# EAGLE design OLED(64x32)V2 (EAGLE 6.5.0)
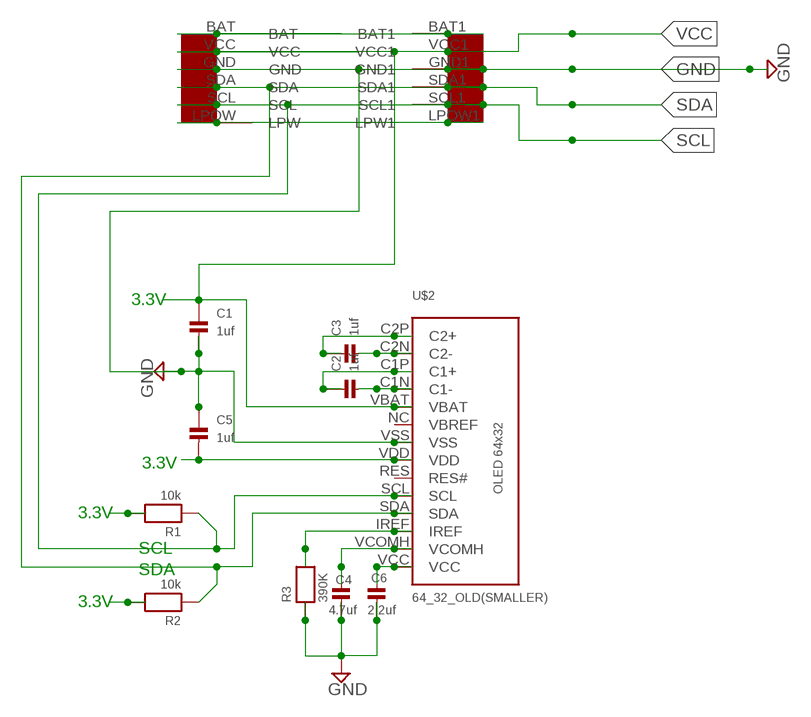
[diagram p0: schematic, sheet 1]

## Parts
C1  1uf  CAP_CERAMIC0603  [0603]
C2  1uf  CAP_CERAMIC0603  [0603]
C3  1uf  CAP_CERAMIC0603  [0603]
C4  4.7uf  CAP_CERAMIC0603  [0603]
C5  1uf  CAP_CERAMIC0603  [0603]
C6  2.2uf  CAP_CERAMIC0603  [0603]
R1  10k  RESISTOR0603  [0603]
R2  10k  RESISTOR0603  [0603]
R3  390K  RESISTOR0603  [0603]
U$1  EZ-I2CHEADERV1  [EZ-I2CHEADERV1]
U$2  64_32_OLD(SMALLER)  [62_32_OLED(SMALLER)]

## Nets
BAT: U$1.BAT U$1.BAT1
GND: C1.2 C4.2 C5.1 C6.2 R3.1 U$1.GND U$1.GND1 U$2.VSS
LPW: U$1.LPOW1(LPW1) U$1.LPOW(LPW)
N$2: C2.2 U$2.C1N(C1-)
N$3: C2.1 U$2.C1P(C1+)
N$4: C3.2 U$2.C2N(C2-)
N$5: C3.1 U$2.C2P(C2+)
N$6: R3.2 U$2.IREF
N$7: C4.1 U$2.VCOMH
N$8: C6.1 U$2.VCC
SCL: R1.1 U$1.SCL U$1.SCL1 U$2.SCL
SDA: R2.1 U$1.SDA U$1.SDA1 U$2.SDA
VCC: C1.1 C5.2 R1.2 R2.2 U$1.VCC U$1.VCC1 U$2.VBAT U$2.VDD
Unconnected: U$2.NC(VBREF) U$2.RES(RES#)

## Notes on the sheet
- 3.3V
- 3.3V
- 3.3V
- SCL
- SDA
- 3.3V

## Library data of the parts
C1-C6 = microbuilder:CAP_CERAMIC: Ceramic Capacitors 0402 - 0402 Surface Mount Capacitors 16pF 50V 5% [Digikey: 445-4899-2-ND] 18pF 50V 5% [Digikey: 490-1281-2-ND] 22pF 50V 5% [Digikey: 490-1283-2-ND] 68pF 50V 5% [Digikey: 490-1289-2-ND] 0.1uF 10V 10% [Digikey: 490-1318-2-ND] 1.0uF 6.3V 10% [Digikey: 490-1320-2-ND] 0603 - 0603 Surface Mount Capacitors 16 pF 50V 5% [Digikey: 445-5051-2-ND] 22 pF 50V [Digikey: PCC220ACVTR-ND] 33 pF 50V 5% [Digikey: 490-1415-1-ND] 56pF 50V 5% [Digikey: 490-1421-1-ND] 220pF 50V 5% [Digikey: 445-1285-1-ND] 680 pF 50V 2200 pF 50V 5% C0G [Digikey: 445-1297-1-ND] 5600 pF 100V 5% X7R [Digikey: 478-3711-1-ND] 0.1 µF 25V 10% [Digikey: PCC2277TR-ND] 0.22 µF 16V 10% X7R [Digikey: 445-1318-1-ND] 1.0 µF 25V 10% [Digikey: 445-5146-2-ND] 0603 - RF Specific 3pF 250V +/-0.1pF RF [Digikey: 712-1347-1-ND] 18 pF 250V 5% [Digikey: 478-3505-1-ND or 712-1322-1-ND] 56 pF 250V 5% C0G RF [Digikey: 490-4867-1-ND] 68 pF 250V RF [Digikey: 490-4868-1-ND] 0805 - 0805 Surface Mount Capacitors 220 pF 250V 2% RF Ceramic Capacitor [Digikey: 712-1398-1-ND] 1000 pF 50V 2% NP0 Ceramic Capacitor [Digikey: 478-3760-1-ND] 0.1 µF 25V 10% Ceramic Capacitor [Digikey: PCC1828TR-ND] 1.0 µF 16V 10% Ceramic Capacitor[Digikey: 490-1691-2-ND] 10.0 µF 10V 10% Ceramic Capacitor[Digikey: 709-1228-1-ND] 10.0 uF 16V 10% Ceramic Capacitor [Digikey: 478-5165-2-ND] 47 uF 6.3V 20% Ceramic Capacitor [Digikey: 587-1779-1-ND or 399-5506-1-ND] 1206 - 1206 Surface Mount Capacitors 47uF 10V 20% Ceramic Capacitor [Digikey: 490-5528-1-ND or 399-5508-1-ND or 445-6010-1-ND] 100uF 6.3V -20%, +80% Y5V Ceramic Capacitor (Digikey: 490-4512-1-ND, Mouser: 81-GRM31CF50J107ZE1L)
R1-R3 = microbuilder:RESISTOR: Resistors 0402 - 0402 Surface Mount Package 22 Ohm 1% 1/16W [Digikey: 311-22.0LRTR-ND] 33 Ohm 5% 1/16W 1.0K 5% 1/16W 1.5K 5% 1/16W 2.0K 1% 1/16W 10.0K 1% 1/16W [Digikey: 311-10.0KLRTR-ND] 10.0K 5% 1/16W [Digikey: RMCF0402JT10K0TR-ND] 12.1K 1% 1/16W [Digikey: 311-22.0LRTR-ND] 100.0K 5% 1/16W 0603 - 0603 Surface Mount Package 0 Ohm 1/10 Watt 1% Resistor 15 Ohm 1/10 Watt 1% Resistor 33 Ohm 1/10 Watt 1% Resistor 49.9 Ohm 1/10 Watt 1% Resistor 100 Ohm 1/10 Watt 1% Resistor 150 Ohm 1/10 Watt 1% Resistor 240 Ohm 1/10 Watt 1% Resistor 390 Ohm 1/10 Watt 1% Resistor 560 Ohm 1/10 Watt 1% Resistor 680 Ohm 1/10 Watt 1% Resistor 750 Ohm 1/10 Watt 1% Resistor 1.0K Ohm 1/10 Watt 1% Resistor 1.5K Ohm 1/10 Watt 1% Resistor 2.0K Ohm 1/10 Watt 1% Resistor 2.2K Ohm 1/10 Watt 1% Resistor 3.3K Ohm 1/10 Watt 1% Resistor 4.7K Ohm 1/10 Watt 1% Resistor 10.0K Ohm 1/10 Watt 1% Resistor 12.0K Ohm 1/10 Watt 1% Resistor 12.1K Ohm 1/10 Watt 1% Resistor 20.0K Ohm 1/10 Watt 1% Resistor 33.0K Ohm 1/10 Watt 1% Resistor 100.0K Ohm 1/10 Watt 1% Resistor 0805 - 0805 Surface Mount Package 0 Ohm 1/8 Watt 1% Resistor 33 Ohm 1/8 Watt 1% Resistor 100 Ohm 1/8 Watt 1% Resistor 150 Ohm 1/8 Watt 1% Resistor 200 Ohm 1/8 Watt 1% Resistor 240 Ohm 1/8 Watt 1% Resistor 330 Ohm 1/8 Watt 1% Resistor 390 Ohm 1/8 Watt 1% Resistor 470 Ohm 1/8 Watt 1% Resistor 1.0K Ohm 1/8 Watt 1% Resistor 1.5K Ohm 1/8 Watt 1% Resistor 2.0K Ohm 1/8 Watt 1% Resistor 4.7K Ohm 1/8 Watt 1% Resistor 5.1K Ohm 1/8 Watt 1% Resistor 5.6K Ohm 1/8 Watt 1% Resistor 10.0K Ohm 1/8 Watt 1% Resistor 22.0K Ohm 1/8 Watt 1% Resistor 33.0K Ohm 1/8 Watt 1% Resistor 100K Ohm 1/8 Watt 1% Resistor 1206 - 1206 Surface Mount Package 2012 - 2010 Surface Mount Package 0.11 Ohm 1/2 Watt 1% Resistor - Digikey: RHM.11UCT-ND
U$1 = UniqueInteractionsLib:EZ-I2CHEADERV1
U$2 = UniqueInteractionsLib:64_32_OLD(SMALLER)

## Board
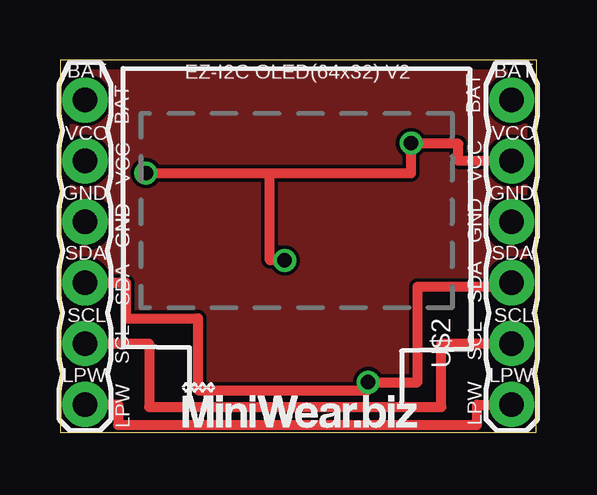
[diagram p1: board, top side]
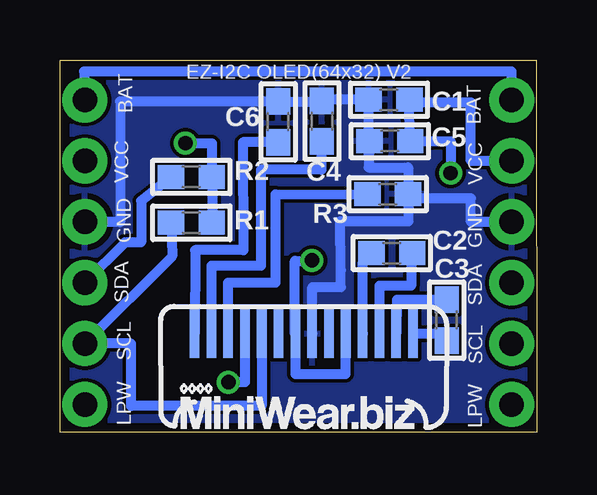
[diagram p2: board, bottom side, seen from below]

Size 19.85 x 15.54 mm. Coordinates in mm from the lower left corner, seen from the top.
Outline: 0,0 19.84,0 19.85,15.54 0.01,15.53 0,0
Copper layers (1*16): Top 0.0356mm / dielectric 1.5011mm / Bottom 0.0356mm
Design rules "oshParkPCBDesignRules": minimum track width 6mil, minimum drill 13mil, track to track 6mil, track to pad 6mil, pad to pad 6mil, via to via 6mil, smd to smd 6mil, copper to edge 15mil, drill to drill 6mil, minimum pad ring 7mil, minimum via ring 7mil, stop-mask expansion 3mil, vias tented up to drill 0mil, thermal gap 10mil

### Footprints (pad centres in the part's own frame; a part is rotated, then mirrored left to right if it is on the bottom)
0603 = smd 1.1 x 1: 1 -0.85,0; 2 0.85,0
EZ-I2CHEADERV1 = drill 1.016 pad 1.88: BAT 0,-1.27; BAT1 17.78,-1.27; GND 0,-6.35; GND1 17.78,-6.35; LPOW 0,-13.97; LPOW1 17.78,-13.97; SCL 0,-11.43; SCL1 17.78,-11.43; SDA 0,-8.89; SDA1 17.78,-8.89; VCC 0,-3.81; VCC1 17.78,-3.81
62_32_OLED(SMALLER) = smd 2.02 x 0.4 bottom: C1N 5.13,-2.125; C1P 5.13,-2.825; C2N 5.13,-3.525; C2P 5.13,-4.225; IREF 5.13,3.475; NC 5.13,-0.725; RES 5.13,1.375; SCL 5.13,2.075; SDA 5.13,2.775; VBAT 5.13,-1.425; VCC 5.13,4.875; VCOMH 5.13,4.175; VDD 5.13,0.675; VSS 5.13,-0.025

### Placement (x,y rotation side)
C1  6.15,13.88 180 bottom
C2  6.03,7.48 180 bottom
C3  3.74,4.69 90 bottom
C4  8.94,12.99 90 bottom
C5  6.11,12.15 0 bottom
C6  10.76,12.96 90 bottom
R1  14.38,8.75 0 bottom
R2  14.38,10.66 0 bottom
R3  6.2,9.94 180 bottom
U$1  1.04,15.14 0 top
U$2  9.38,9.25 270 top
U$3  [LOGO2]  14.95,-0.03 0 bottom
U$6  [LOGO2]  5,0.02 0 top

### Tracks (layer width: path | path; a pad name or v marks a point on that pad's centre or on a via)
BAT
  Bottom 0.406: U$1.BAT 1.04,15.06 18.85,15.06 18.85,13.87 U$1.BAT1
GND
  Bottom 0.406: R3.1 5.35,11.06 7,11.06 C5.1 7,11.56 C1.2 8.94,13.88 C4.2 8.94,13.81 C6.2 17.35,13.81 17.35,8.77 18.82,8.77 U$1.GND1 | U$2.VSS 9.34,6.07 8.15,6.07 8.15,6.76 8.17,8.82 5.33,8.82 5.32,9.33 R3.1 | U$1.GND 2.74,8.79 2.74,9.76 5.35,9.76 R3.1
  pour Top: -0.06,15.67 19.96,15.68 20.06,-0.07 10.68,-0.04 1.41,-0.07 0.81,-0.12 -0.14,-0.17
  pour Bottom: -0.16,-0.2 1.58,-0.07 1.57,-0.05 10.76,-0.07 10.72,-0.08 20.06,-0.03 19.97,15.7 -0.06,15.63
LPW
  Top 0.406: U$1.LPOW 2.42,1.17 2.42,0.32 17.38,0.32 17.38,1.16 U$1.LPOW1
N$2
  Bottom 0.406: U$2.C1N 7.24,7.12 C2.2
N$3
  Bottom 0.406: C2.1 5.23,7.48 5.23,6.12 6.55,6.12 U$2.C1P
N$4
  Bottom 0.406: C3.2 5.82,5.53 U$2.C2N
N$5
  Bottom 0.406: C3.1 3.79,4.12 U$2.C2P
N$6
  Bottom 0.406: U$2.IREF 12.85,6.25 10.87,6.25 10.87,9.93 R3.2
N$7
  Bottom 0.406: C4.1 8.96,12.14 8.96,10.96 11.48,10.96 11.48,6.95 13.55,6.95 U$2.VCOMH
N$8
  Bottom 0.406: C6.1 12.23,12.11 12.21,7.61 14.23,7.61 U$2.VCC
SCL
  Top 0.406: U$1.SCL 3.71,3.71 3.71,1.07 15.89,1.07 15.89,3.71 U$1.SCL1
  Bottom 0.406: R1.1 15.18,7.35 U$1.SCL1 16.89,3.71 16.89,1.11 11.45,1.11 U$2.SCL
SDA  (via drill 0.6)
  Top 0.406: U$1.SDA1 18.82,6.09 14.9,6.09 14.9,2.1 v12.84,2.1 12.84,1.76 5.74,1.76 5.74,4.76 2.74,4.76 2.74,6.25 U$1.SDA
  Bottom 0.406: R2.1 16.48,9.66 16.48,7.93 17.14,7.93 U$1.SDA1 | U$2.SDA 12.15,2.1 v12.84,2.1
VCC  (via drill 0.6)
  Top 0.406: U$1.VCC1 16.6,11.33 16.6,12.05 14.63,12.05 v14.63,12.07 14.63,10.82 8.74,10.82 | v3.58,10.82 8.74,10.82 | v9.36,7.18 8.74,7.18 8.74,10.82
  Bottom 0.406: R1.2 13.48,8.74 R2.2 13.53,12.07 v14.63,12.07 | U$2.VBAT 7.95,2.44 10.05,2.44 U$2.VDD 10.07,4.12 10.07,7.16 9.36,7.16 v9.36,7.18 | U$1.VCC 2.74,11.33 2.74,13.76 5.3,13.76 C1.1 5.32,13.88 C5.2 3.58,12.15 v3.58,10.82

### Text on the board
tNames: EZ-I2C OLED(64x32) V2
bNames: EZ-I2C OLED(64x32) V2